# EasyEDA schematic SCH_ESP32 Panasonic Aquarea_2023-09-12.json
TITLE: ESP32 Panasonic Aquarea Interface; REV: 1.2; Date: 2023-09-02; Sheet: 1/1; Drawn By: Krzysztof Sala; Company: none
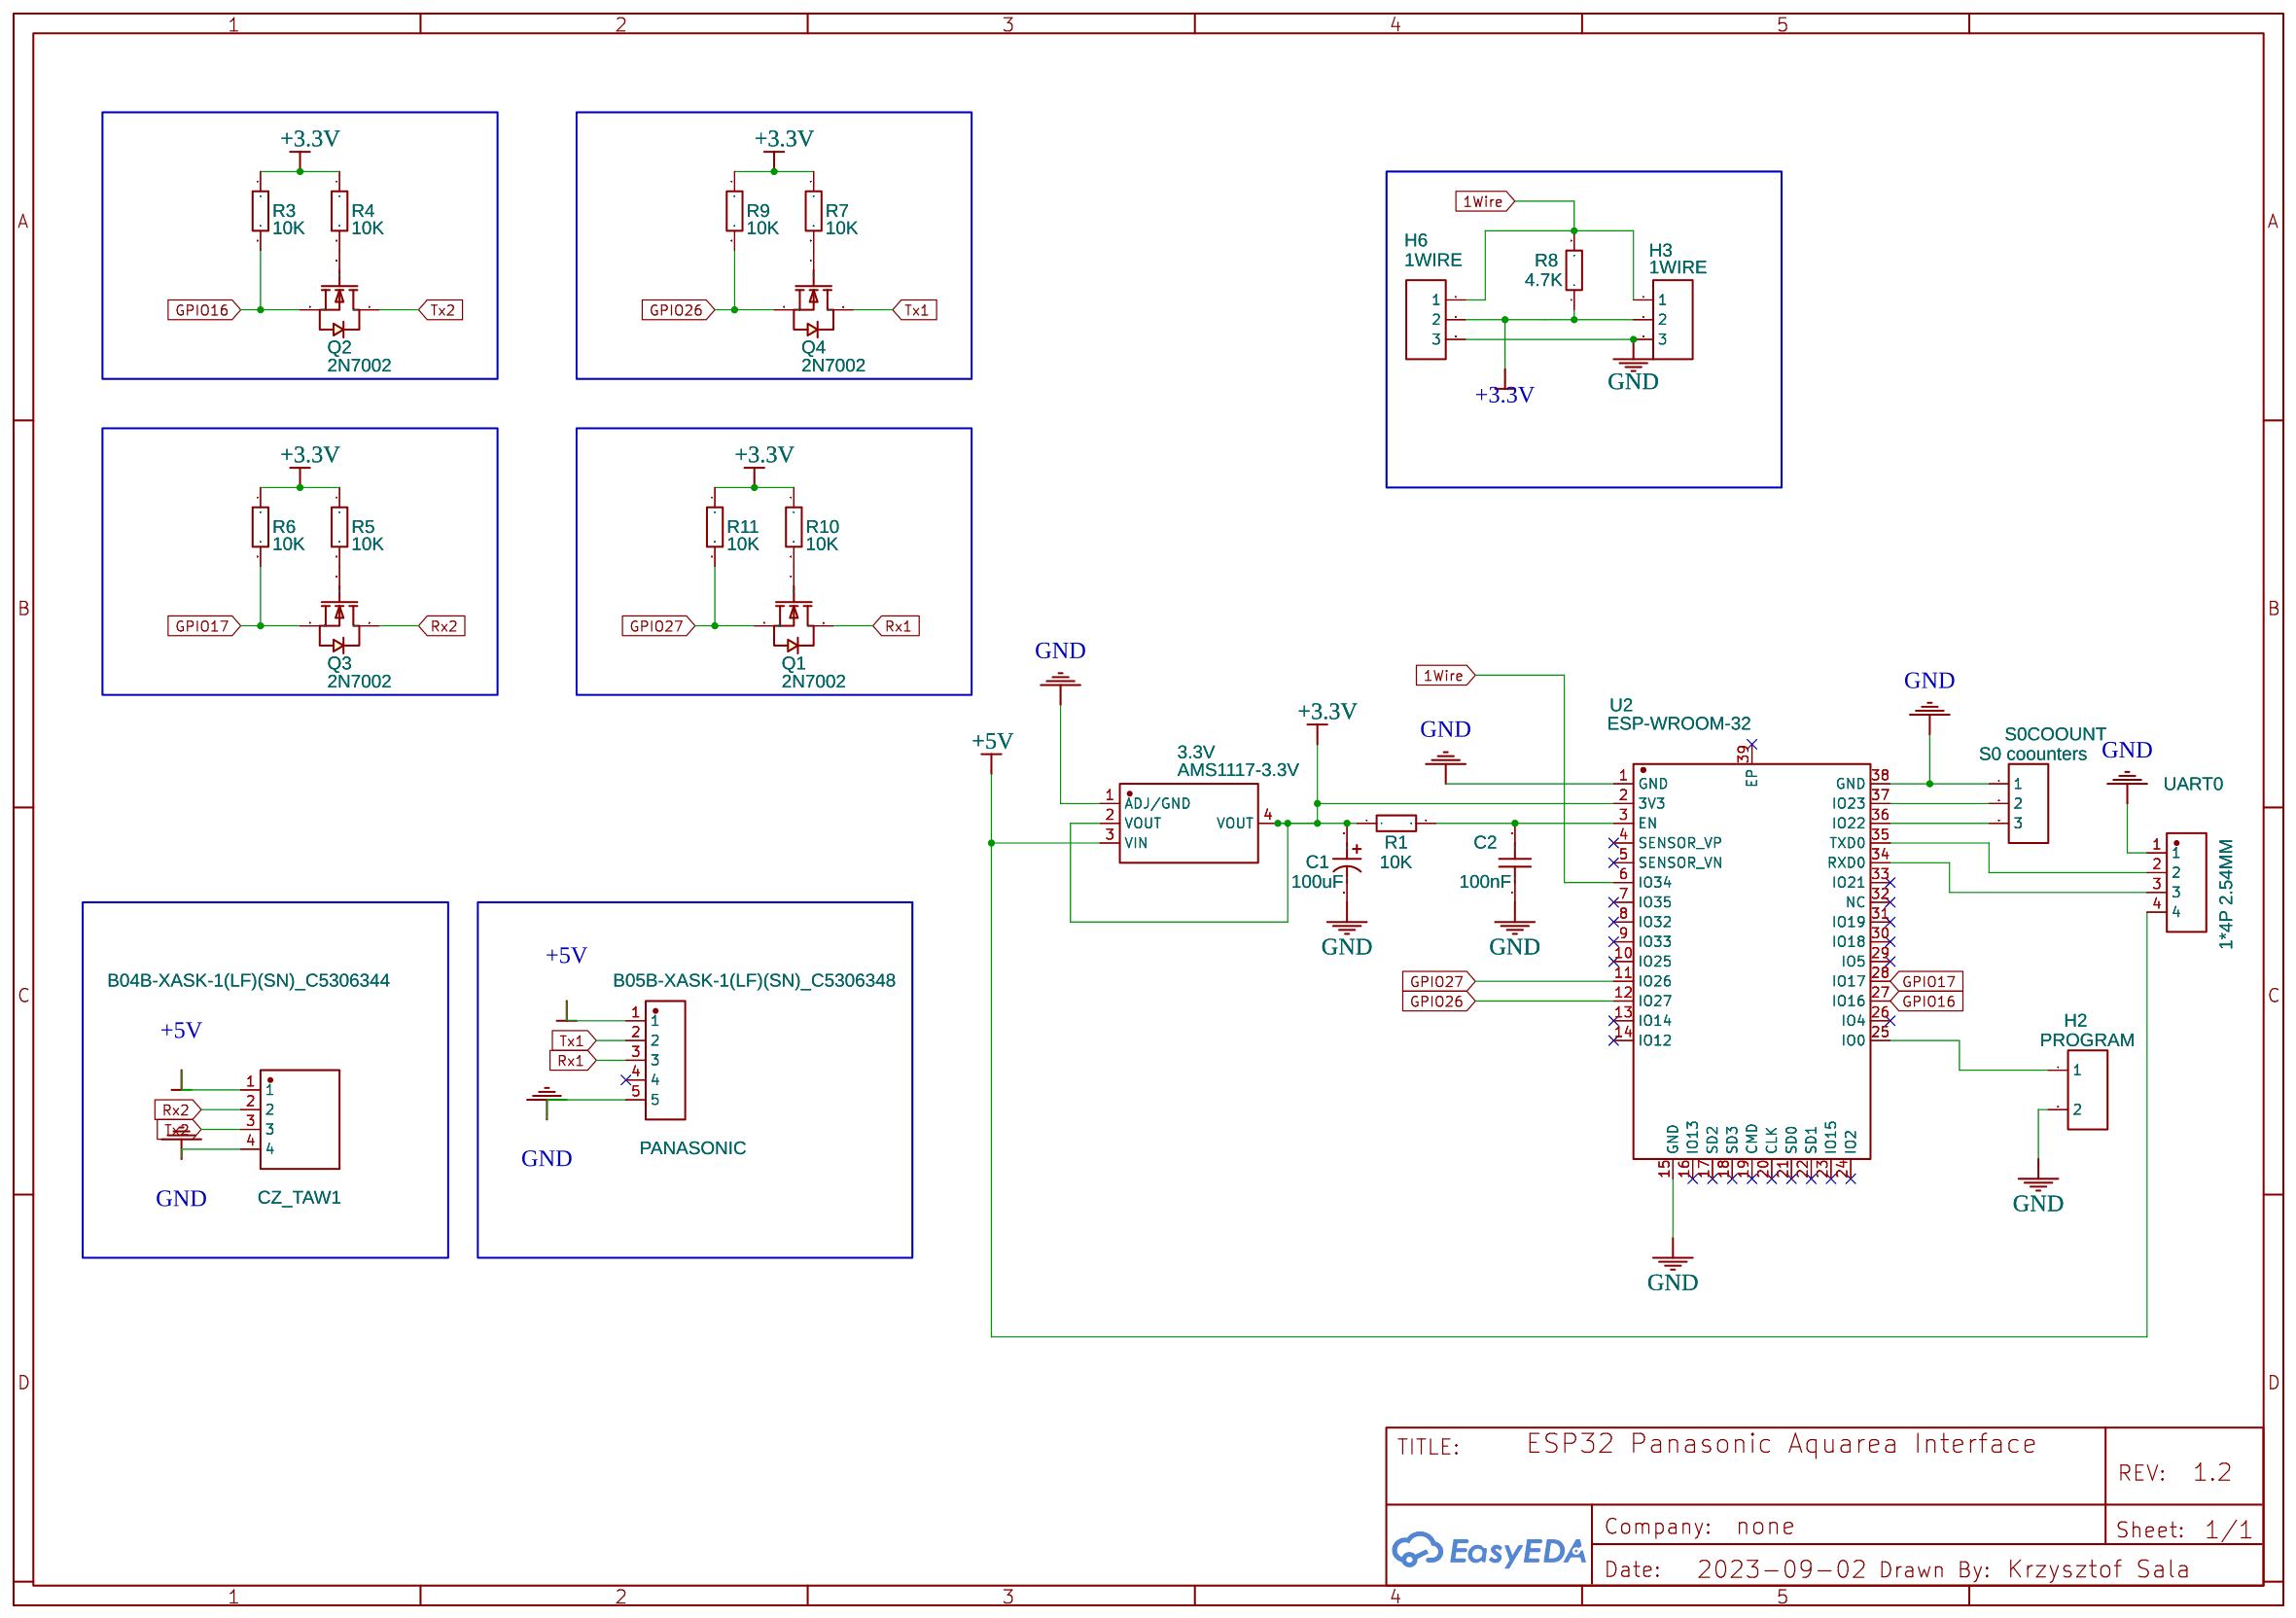
[diagram p0: schematic sheet]

## Parts
3.3V  AMS1117-3.3V  [SOT-223-4_L6.5-W3.5-P2.30-LS7.0-BR]
C1  100uF  [CAP-TH_BD6.3-P2.50-D0.6-FD]
C2  100nF  [C1206]
CZ_TAW1  B04B-XASK-1(LF)(SN)_C5306344  [CONN-TH_B04B-XASK-1-LF-SN]
H2  PROGRAM  [HDR-TH_2P-P2.54-V-M-1]
H3  1WIRE  [HDR-TH_3P-P2.54-V]
H6  1WIRE  [HDR-TH_3P-P2.54-V]
PANASONIC  B05B-XASK-1(LF)(SN)_C5306348  [CONN-TH_B05B-XASK-1-LF-SN]
Q1  2N7002  [SOT-23(SOT-23-3)]
Q2  2N7002  [SOT-23(SOT-23-3)]
Q3  2N7002  [SOT-23(SOT-23-3)]
Q4  2N7002  [SOT-23(SOT-23-3)]
R1  10K  [R1206]
R3  10K  [R1206]
R4  10K  [R1206]
R5  10K  [R1206]
R6  10K  [R1206]
R7  10K  [R1206]
R8  4.7K  [R1206]
R9  10K  [R1206]
R10  10K  [R1206]
R11  10K  [R1206]
S0COOUNT  S0 coounters  [HDR-TH_3P-P2.54-V]
U2  ESP-WROOM-32  [WIFIM-SMD_ESP-WROOM-32]
UART0  1*4P 2.54MM  [HDR-TH_4P-P2.54-V-C4_TH-4_2.5X10.5X2.54P]

## Library data of the parts
3.3V = AMS1117-3.3V: Contributor: LCSC; Supplier: LCSC; Supplier Part: C2688239; Manufacturer: WPMtek(维攀微); JLCPCB Part Class: Extended Part; link: https://lcsc.com/eda_search?q=C2688239&%26type=1&ref=editor
C1 = HS1C107M0507PC: Supplier: LCSC; Supplier Part: C2895831; Manufacturer: HONOR(荣誉); link: https://atta.szlcsc.com/upload/public/pdf/source/20210928/03EF1DB68D9E7AA6E544095DEF5878B9.pdf; JLCPCB Part Class: Extended Part; Contributor: lcsc
C2 = GRM31C5C1E104JA01L_C426117: Supplier: LCSC; Supplier Part: C426117; Manufacturer: muRata(村田); Manufacturer Part: GRM31C5C1E104JA01L; Contributor: LCSC; JLCPCB Part Class: Extended Part
CZ_TAW1 = B04B-XASK-1(LF)(SN)_C5306344: Contributor: lcsc; Supplier: LCSC; Supplier Part: C5306344; Manufacturer: JST; Manufacturer Part: B04B-XASK-1(LF)(SN); link: https://lcsc.com/eda_search?q=C5306344&%26type=1&ref=editor
H2 = -: Supplier: LCSC; Manufacturer: TE Connectivity; Manufacturer Part: 826629-2; image: //image.lceda.cn/szlcsc/C86471.jpg; Supplier Part: C86471
H3 H6 S0COOUNT = -: Supplier: LCSC; Manufacturer: BOOMELE; Manufacturer Part: Header2.54mm 1*3P; image: //image.lceda.cn/szlcsc/C49257.jpg; Supplier Part: C49257
PANASONIC = B05B-XASK-1(LF)(SN)_C5306348: Contributor: lcsc; Supplier: LCSC; Supplier Part: C5306348; Manufacturer: JST; Manufacturer Part: B05B-XASK-1(LF)(SN); link: https://lcsc.com/eda_search?q=C5306348&%26type=1&ref=editor
Q1-Q4 = -: Supplier: LCSC; Manufacturer: CJ; LCSC Assembly: Yes; image: //image.lceda.cn/szlcsc/C8545.jpg; Supplier Part: C8545; SMT Type: Basic
R1 R3-R7 R9-R11 = 0603WAF1002T5E: Supplier: LCSC; Manufacturer: UniOhm; LCSC Assembly: Yes; Supplier Part: C25804; SMT Type: Basic
R8 = 0603WAF4701T5E: Supplier: LCSC; Manufacturer: UniOhm; LCSC Assembly: Yes; Supplier Part: C23162; SMT Type: Basic
U2 = ESP-WROOM-32: Supplier: LCSC; Manufacturer: ESPRESSIF(乐鑫); Manufacturer Part: ESP32-WROOM-32; Supplier Part: C95209; JLCPCB Part Class: Extended Part
UART0 = 1*4P 2.54MM: Contributor: LCSC; Supplier: LCSC; Supplier Part: C2887121; Manufacturer: null; Manufacturer Part: 单排直插排针 1*4P 2.54mm; JLCPCB Part Class: Extended Part; link: https://lcsc.com/eda_search?q=C2887121&%26type=1&ref=editor

## Nets
+3.3V: 3.3V.2(VOUT) 3.3V.4(VOUT) C1.1 H3.2 H6.2 R1.1 R3.1 R4.1 R5.1 R6.1 R7.1 R8.1 R9.1 R10.1 R11.1 U2.2(3V3)
+5V: 3.3V.3(VIN) CZ_TAW1.1 PANASONIC.1 UART0.4
GND: 3.3V.1(ADJ/GND) C1.2 C2.1 CZ_TAW1.4 H2.2 H3.3 H6.3 PANASONIC.5 S0COOUNT.1 U2.1(GND) U2.15(GND) U2.38(GND) UART0.1
1Wire: H3.1 H6.1 R8.2 U2.6(IO34)
GPIO16: Q2.2(S) R3.2 U2.27(IO16)
GPIO17: Q3.2(S) R6.2 U2.28(IO17)
GPIO26: Q4.2(S) R9.2 U2.12(IO27)
GPIO27: Q1.2(S) R11.2 U2.11(IO26)
Rx1: PANASONIC.3 Q1.3(D)
Rx2: CZ_TAW1.2 Q3.3(D)
Tx1: PANASONIC.2 Q4.3(D)
Tx2: CZ_TAW1.3 Q2.3(D)
Net-(C2-2): C2.2 R1.2 U2.3(EN)
Net-(H2-1): H2.1 U2.25(IO0)
Net-(Q1-1): Q1.1(G) R10.2
Net-(Q2-1): Q2.1(G) R4.2
Net-(Q3-1): Q3.1(G) R5.2
Net-(Q4-1): Q4.1(G) R7.2
Net-(S0COOUNT-2): S0COOUNT.2 U2.37(IO23)
Net-(S0COOUNT-3): S0COOUNT.3 U2.36(IO22)
Net-(U2-34): U2.34(RXD0) UART0.3
Net-(U2-35): U2.35(TXD0) UART0.2

Not connected (* = marked no-connect by the designer): PANASONIC 4*; U2 4(SENSOR_VP)* 5(SENSOR_VN)* 7(IO35)* 8(IO32)* 9(IO33)* 10(IO25)* 13(IO14)* 14(IO12)* 16(IO13)* 17(SD2)* 18(SD3)* 19(CMD)* 20(CLK)* 21(SD0)* 22(SD1)* 23(IO15)* 24(IO2)* 26(IO4)* 29(IO5)* 30(IO18)* 31(IO19)* 32(NC)* 33(IO21)* 39(EP)*
